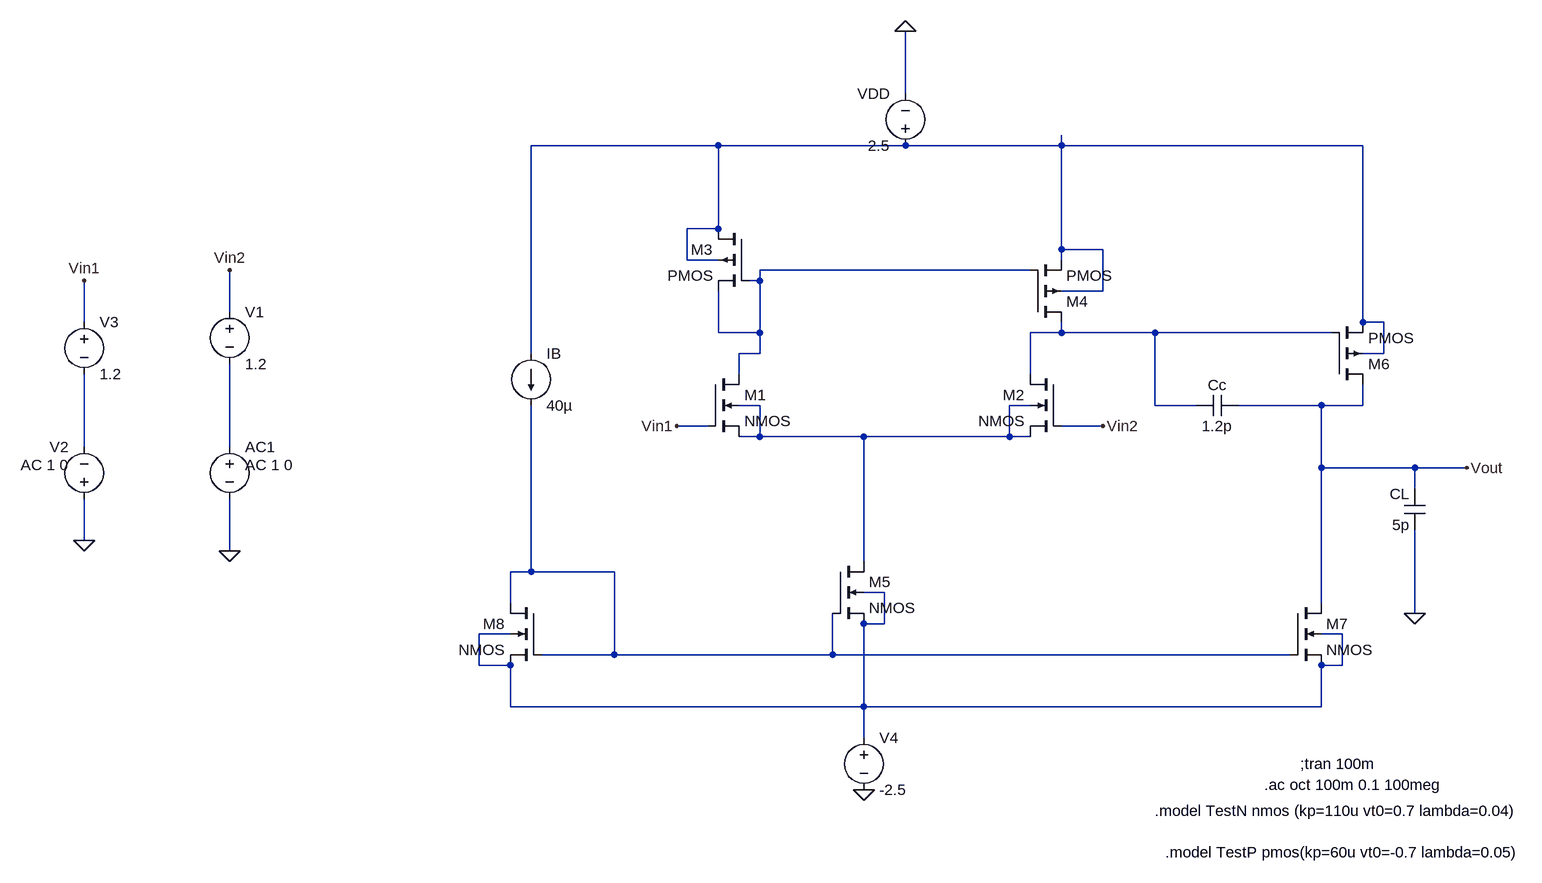
[diagram p0: schematic Commnet ohmazing.asc]
Commnet ohmazing.asc, the LTspice schematic file:
Version 4
SHEET 1 1884 680
WIRE 272 -528 272 -624
WIRE -16 -448 -304 -448
WIRE 272 -448 -16 -448
WIRE 512 -448 512 -464
WIRE 512 -448 272 -448
WIRE 976 -448 512 -448
WIRE -16 -320 -16 -448
WIRE -16 -320 -64 -320
WIRE 512 -288 512 -448
WIRE 576 -288 512 -288
WIRE -64 -272 -64 -320
WIRE -16 -272 -64 -272
WIRE 512 -272 512 -288
WIRE 464 -256 48 -256
WIRE 48 -240 48 -256
WIRE 48 -240 32 -240
WIRE 576 -224 576 -288
WIRE 576 -224 512 -224
WIRE -768 -192 -768 -256
WIRE -992 -176 -992 -240
WIRE 976 -176 976 -448
WIRE 1008 -176 976 -176
WIRE -16 -160 -16 -224
WIRE 48 -160 48 -240
WIRE 48 -160 -16 -160
WIRE 512 -160 512 -176
WIRE 512 -160 464 -160
WIRE 656 -160 512 -160
WIRE 928 -160 656 -160
WIRE -304 -128 -304 -448
WIRE 48 -128 48 -160
WIRE 48 -128 16 -128
WIRE 1008 -128 1008 -176
WIRE 1008 -128 976 -128
WIRE 16 -96 16 -128
WIRE 464 -96 464 -160
WIRE 48 -48 16 -48
WIRE 464 -48 432 -48
WIRE 656 -48 656 -160
WIRE 720 -48 656 -48
WIRE 912 -48 784 -48
WIRE 976 -48 976 -80
WIRE 976 -48 912 -48
WIRE -32 -16 -80 -16
WIRE 576 -16 512 -16
WIRE 48 0 48 -48
WIRE 48 0 16 0
WIRE 208 0 48 0
WIRE 432 0 432 -48
WIRE 432 0 208 0
WIRE 464 0 432 0
WIRE -992 16 -992 -96
WIRE -768 16 -768 -112
WIRE 912 48 912 -48
WIRE 1056 48 912 48
WIRE 1136 48 1056 48
WIRE 1056 80 1056 48
WIRE -992 160 -992 96
WIRE -768 176 -768 96
WIRE 208 192 208 0
WIRE -304 208 -304 -48
WIRE -304 208 -336 208
WIRE -176 208 -304 208
WIRE 240 240 208 240
WIRE -336 256 -336 208
WIRE 912 256 912 48
WIRE 1056 272 1056 144
WIRE 240 288 240 240
WIRE 240 288 208 288
WIRE -336 304 -384 304
WIRE 944 304 912 304
WIRE -176 336 -176 208
WIRE -176 336 -288 336
WIRE 160 336 160 272
WIRE 160 336 -176 336
WIRE 864 336 160 336
WIRE -384 352 -384 304
WIRE -336 352 -384 352
WIRE 944 352 944 304
WIRE 944 352 912 352
WIRE -336 416 -336 352
WIRE 208 416 208 288
WIRE 208 416 -336 416
WIRE 912 416 912 352
WIRE 912 416 208 416
WIRE 208 464 208 416
FLAG 1056 272 0
FLAG 272 -624 0
FLAG -80 -16 Vin1
FLAG 576 -16 Vin2
FLAG -768 176 0
FLAG 1136 48 Vout
FLAG -992 160 0
FLAG -992 -240 Vin1
FLAG -768 -256 Vin2
FLAG 208 544 0
DATAFLAG -176 -448 ""
DATAFLAG 240 416 ""
SYMBOL nmos4 -288 256 M0
SYMATTR InstName M8
SYMATTR Value2 l=500nm w=0.07µm
SYMBOL pmos4 32 -320 M0
SYMATTR InstName M3
SYMATTR Value2 l=500nm w=1µm
SYMBOL pmos4 928 -80 M180
SYMATTR InstName M6
SYMATTR Value2 l=1u w=90u
SYMBOL current -304 -128 R0
WINDOW 123 0 0 Left 0
WINDOW 39 0 0 Left 0
SYMATTR InstName IB
SYMATTR Value 40µ
SYMBOL cap 784 -64 R90
WINDOW 0 0 32 VBottom 2
WINDOW 3 32 32 VTop 2
SYMATTR InstName Cc
SYMATTR Value 1.2p
SYMBOL cap 1072 144 R180
WINDOW 0 24 56 Left 2
WINDOW 3 24 8 Left 2
SYMATTR InstName CL
SYMATTR Value 5p
SYMBOL voltage 272 -432 R180
WINDOW 0 24 96 Left 2
WINDOW 3 24 16 Left 2
WINDOW 123 0 0 Left 0
WINDOW 39 0 0 Left 0
SYMATTR InstName VDD
SYMATTR Value 2.5
SYMBOL voltage -768 0 R0
WINDOW 123 24 44 Left 2
WINDOW 39 0 0 Left 0
WINDOW 3 24 96 Invisible 2
SYMATTR Value2 AC 1 0
SYMATTR Value SINE(0 100u 500 0 0 0)
SYMATTR InstName AC1
SYMBOL nmos4 864 256 R0
SYMATTR InstName M7
SYMATTR Value2 l=1u w=7u
SYMBOL nmos4 160 192 R0
SYMATTR InstName M5
SYMATTR Value2 l=500nm w=0.07µm
SYMBOL pmos4 464 -176 M180
SYMATTR InstName M4
SYMATTR Value2 l=500nm w=1µm
SYMBOL nmos4 -32 -96 R0
SYMATTR InstName M1
SYMATTR Value2 l=1u w=90µm
SYMBOL nmos4 512 -96 M0
SYMATTR InstName M2
SYMATTR Value2 l=1u w=90µm
SYMBOL voltage -768 -208 R0
WINDOW 123 0 0 Left 0
WINDOW 39 0 0 Left 0
SYMATTR InstName V1
SYMATTR Value 1.2
SYMBOL voltage -992 -192 R0
WINDOW 123 0 0 Left 0
WINDOW 39 0 0 Left 0
SYMATTR InstName V3
SYMATTR Value 1.2
SYMBOL voltage -992 112 R180
WINDOW 0 24 96 Left 2
WINDOW 3 24 16 Invisible 2
WINDOW 123 24 68 Left 2
WINDOW 39 0 0 Left 0
SYMATTR InstName V2
SYMATTR Value SINE(0 100u 500 0 0)
SYMATTR Value2 AC 1 0
SYMBOL voltage 208 448 R0
WINDOW 123 0 0 Left 0
WINDOW 39 0 0 Left 0
SYMATTR InstName V4
SYMATTR Value -2.5
TEXT 656 576 Left 2 !.model TestN nmos (kp=110u vt0=0.7 lambda=0.04)
TEXT 672 640 Left 2 !.model TestP pmos(kp=60u vt0=-0.7 lambda=0.05)
TEXT 880 504 Left 2 !;tran 100m
TEXT 824 536 Left 2 !.ac oct 100m 0.1 100meg

The netlist it stands for:
* Commnet ohmazing.asc
M8 N007 N007 N008 N008 NMOS l=500nm w=0.07µm
M3 N001 N002 N002 N001 PMOS l=500nm w=1µm
M6 Vout N003 N001 N001 PMOS l=1u w=90u
IB N001 N007 40µ
Cc Vout N003 1.2p
CL 0 Vout 5p
VDD N001 0 2.5
V§AC1 N006 0 SINE(0 100u 500 0 0 0) AC 1 0
M7 Vout N007 N008 N008 NMOS l=1u w=7u
M5 N004 N007 N008 N008 NMOS l=500nm w=0.07µm
M4 N003 N002 N001 N001 PMOS l=500nm w=1µm
M1 N002 Vin1 N004 N004 NMOS l=1u w=90µm
M2 N003 Vin2 N004 N004 NMOS l=1u w=90µm
V1 Vin2 N006 1.2
V3 Vin1 N005 1.2
V2 0 N005 SINE(0 100u 500 0 0) AC 1 0
V4 N008 0 -2.5
.model NMOS NMOS
.model PMOS PMOS
.lib standard.mos
.model TestN nmos (kp=110u vt0=0.7 lambda=0.04)
.model TestP pmos(kp=60u vt0=-0.7 lambda=0.05)
;tran 100m
.ac oct 100m 0.1 100meg
.backanno
.end